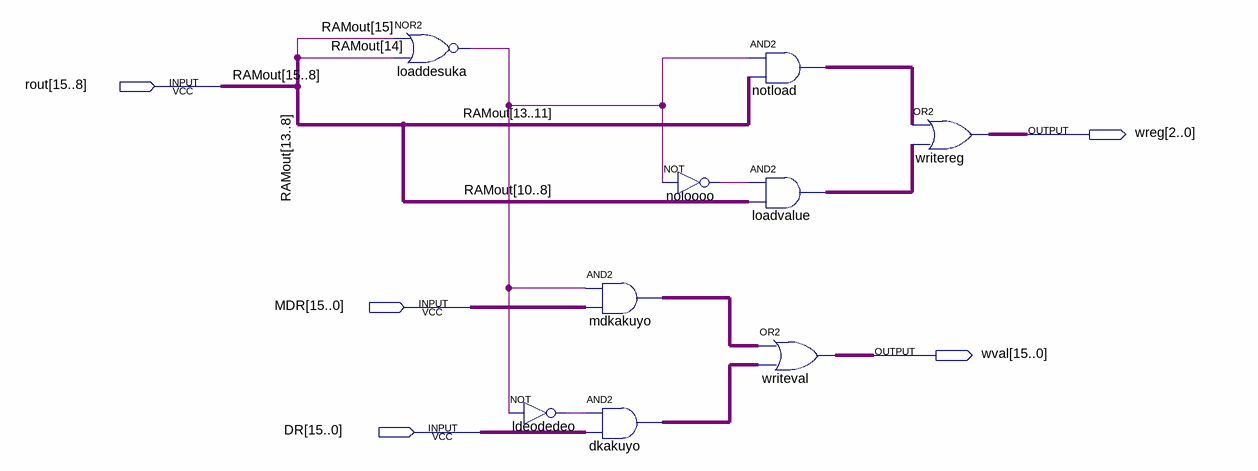
[diagram p0: schematic sheet]
// Quartus schematic writeregcheck.bdf as structural Verilog: 9 symbols, 5 pins
module writeregcheck (
  input  [15:8] rout,
  input  [15:0] MDR,
  input  [15:0] DR,
  output [2:0] wreg,
  output [15:0] wval
);

  wire ldeodedeo_out, loaddesuka_out, noloooo_out;
  wire [2:0] loadvalue_out, notload_out;
  wire [15:0] dkakuyo_out, mdkakuyo_out;

  nor loaddesuka (loaddesuka_out, rout[15], rout[14]);
  not ldeodedeo (ldeodedeo_out, loaddesuka_out);
  assign mdkakuyo_out = {16{loaddesuka_out}} & MDR;  // AND2 mdkakuyo, 16 bits wide
  assign dkakuyo_out = {16{ldeodedeo_out}} & DR;  // AND2 dkakuyo, 16 bits wide
  not noloooo (noloooo_out, loaddesuka_out);
  assign notload_out = {3{loaddesuka_out}} & rout[13:11];  // AND2 notload, 3 bits wide
  assign loadvalue_out = {3{noloooo_out}} & rout[10:8];  // AND2 loadvalue, 3 bits wide
  assign wval = mdkakuyo_out | dkakuyo_out;  // OR2 writeval, 16 bits wide
  assign wreg = notload_out | loadvalue_out;  // OR2 writereg, 3 bits wide

  // Other names for the same wires on the sheet: RAMout[15:8] = rout
endmodule
